# Altium schematic sheet Primary_Transformer.SchDoc
size A4; SheetNumber: 4; SheetTotal: 5
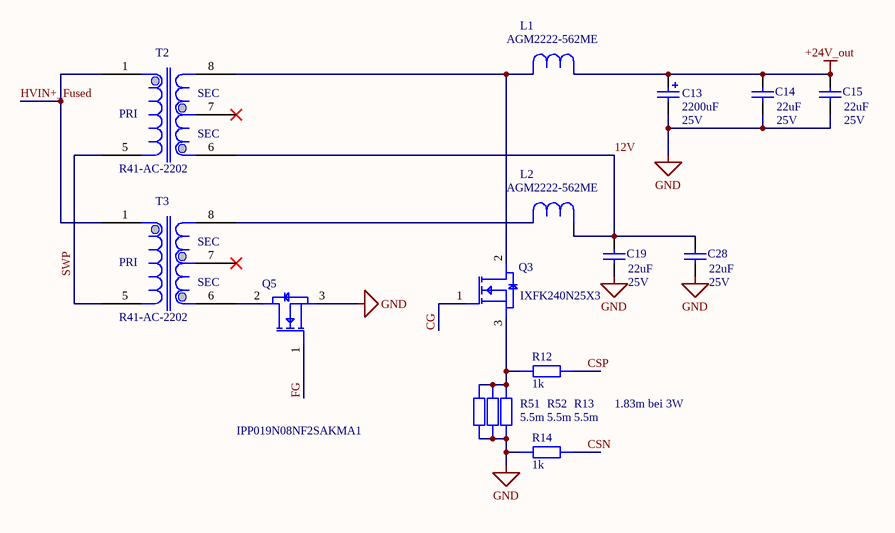
[diagram p0: Primary_Transformer.SchDoc]

## Parts
C13  Capacitance: 2200uF  Voltage: 25V  [WCAP-ATG8_D13H25]
C14  Capacitance: 22uF  Voltage: 25V  [WCAP-CSGP_1210_H=2.5mm]
C15  Capacitance: 22uF  Voltage: 25V  [WCAP-CSGP_1210_H=2.5mm]
C19  Capacitance: 22uF  Voltage: 25V  [WCAP-CSGP_1210_H=2.5mm]
C28  Capacitance: 22uF  Voltage: 25V  [WCAP-CSGP_1210_H=2.5mm]
L1  AGM2222-562ME  [AGM2222-562]
L2  AGM2222-562ME  [AGM2222-562]
Q3  IXFK240N25X3  [IXFK240N25X3_w_Cooler]
Q5  IPP019N08NF2SAKMA1  [IPP019N08NF2SAKMA1_w_Cooler]
R12  value 1k  [STACKPOLE CSR1206]  (hidden comment: SMD Resistor)
R13  value 5.5m  [STACKPOLE CSR1206]
R14  value 1k  [STACKPOLE CSR1206]  (hidden comment: SMD Resistor)
R51  value 5.5m  [STACKPOLE CSR1206]
R52  value 5.5m  [STACKPOLE CSR1206]
T2  R41-AC-2202  [R41-AC-2202 Landing Pattern]
T3  R41-AC-2202  [R41-AC-2202 Landing Pattern]

## Nets
+24V_out: C13.1(P) C14.1 C15.1 L1.2
GND: C13.2(N) C14.2 C15.2 C19.2 C28.2 Q5.3 R13.1 R14.1 R51.1 R52.1
12V: C19.1 C28.1 L2.2 T2.6
CG: Q3.1
CSN: R14.2
CSP: R12.2
FG: Q5.1
HVIN+_Fused: T2.1 T3.1
SWP: T2.5 T3.5
NetL1_1: L1.1 Q3.2 T2.8
NetL2_1: L2.1 T3.8
NetQ3_3: Q3.3 R12.1 R13.2 R51.2 R52.2
NetQ5_2: Q5.2 T3.6

Not connected (* = marked no-connect by the designer): T2 7*; T3 7*

## Notes on the sheet
- 1.83m bei 3W
- (in symbol R41-AC-2202) SEC; PRI

## Library data of the parts
C13 = 860010478021: WCAP-ATG8 Aluminum Electrolytic Capacitor, Radial, THT, D13xH25, 2200uF, 25V; Manufacturer: Wurth Elektronik; Ripple Current: 1705mA; Rated Voltage: 25VDC; Technical Reference: ATBI250222M025DSPACB000; Leakage Current: 550uA; Endurance: 2000h; Dissipation Factor: 14%; Capacitance Tolerance: +/-20%; ComponentLink2Description: Datasheet; Published Date: October 2020; Packaging: Ammo Pack; Operating Temperature: -40 to +85degC; Mounting Technology: THT; Manufacturer Part Number: 860010478021; Height: 25mm; Diameter: 13mm; ComponentLink2URL: https://www.we-online.com/catalog/datasheet/860010478021.pdf; ComponentLink1URL: http://www.we-online.de; ComponentLink1Description: Manufacturer
C14 C15 C19 C28 = 885012109014: WCAP-CSGP Multilayer Ceramic Chip Capacitor, General Purpose, size 1210, X5R, 22uF, 25V; Manufacturer: Wurth Elektronik; Rated Voltage: 25VDC; Isolation Resistance  min.: 0.005GOhm; Capacitance Tolerance: +/-20%; Dissipation Factor max.: 5%; Technical Reference: X5R1210226M025DFCT10000; ComponentLink1Description: Manufacturer; ComponentLink1URL: http://www.we-online.de; ComponentLink2Description: Datasheet; ComponentLink2URL: https://www.we-online.com/catalog/datasheet/885012109014.pdf; Operating Temperature: -55 to +85degC; Packaging: Tape and Reel; Manufacturer Part Number: 885012109014; Published Date: April 2021; Ceramic Type: X5R; Height: 2.5mm; Mounting Technology: SMT; Size: 1210; Q-Factor min.: -
L1 L2 = AGM2222-562ME: Shielded Power Inductors; ComponentLink1Description: Coilcraft; ComponentLink1URL: https://www.coilcraft.com/en-us/products/power/shielded-inductors/high-current-flat-wire/agp-ver/agm2222/?skuId=30439; ComponentLink2Description: Datasheet; ComponentLink2URL: https://www.coilcraft.com/getmedia/d4f4984d-2507-4e11-ae3d-89829a15fb28/agm2222.pdf
Q3 = IXFK240N25X3: Mosfet N-ch 250V 240A TO264; Manufacturer: IXYS; Supplier 1: Mouser; Manufacturer Part Number: IXFK240N25X3; RoHS: No; Stock 1: 7; Pricing 1: 1=30,00000, 10=27,67000, 50=25,40000, 100=24,04000, 1000=24,04000, 10000=24,04000 (USD)
Q5 = IPP019N08NF2SAKMA1: Transistor Power MOSFET N-Channel 80V 191A 3-Pin TO-220 Tube; Manufacturer: Infineon; Supplier 1: Digi-Key; Manufacturer Part Number: IPP019N08NF2SAKMA1; RoHS: No; Category: Uncategorized; Stock 1: 760; Pricing 1: 1=3,34000, 10=2,99500, 100=2,45420, 500=2,09760 (USD)
R12-R14 R51 R52 = SMD Resistor: Resistor with multiple footprints
T2 T3 = R41-AC-2202: High Voltage Transformer